# Altium schematic sheet dv_spectrum_main.SchDoc
size A3
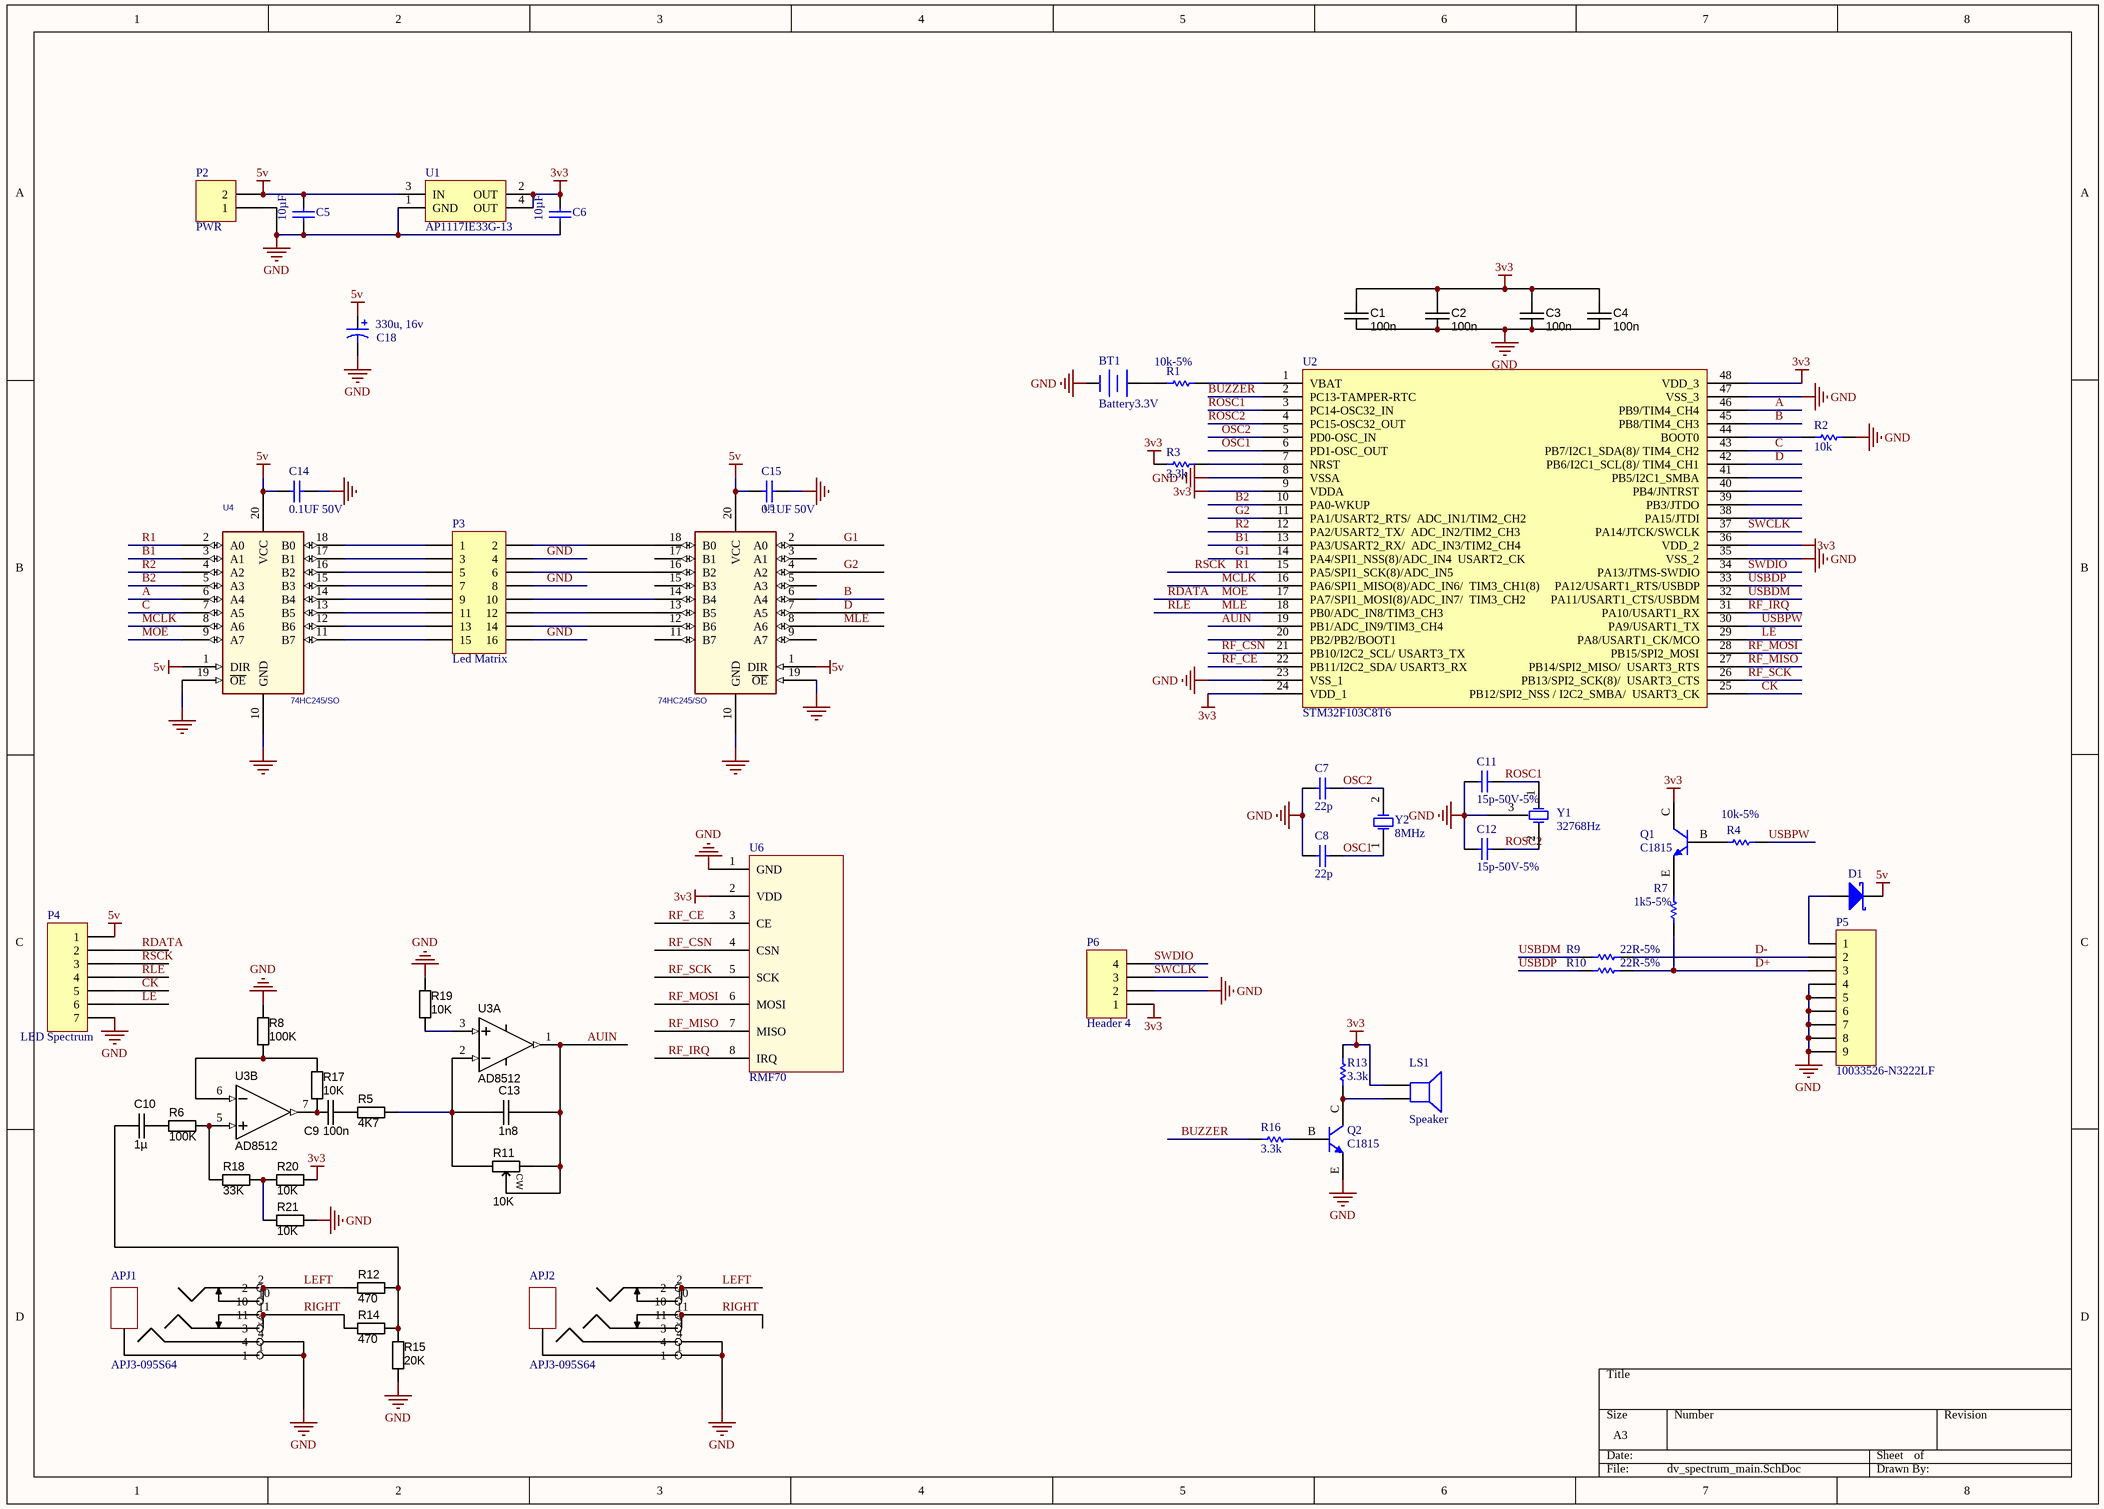
[diagram p0: dv_spectrum_main.SchDoc]

## Parts
APJ1  APJ3-095S64  [APJ3-095S64]
APJ2  APJ3-095S64  [APJ3-095S64]
BT1  Battery3.3V  [CR1220]
C1  value 100n  [CAPC2012X135N]  (hidden comment: approved sub OK)
C2  value 100n  [CAPC2012X135N]  (hidden comment: approved sub OK)
C3  value 100n  [CAPC2012X135N]  (hidden comment: approved sub OK)
C4  value 100n  [CAPC2012X135N]  (hidden comment: approved sub OK)
C5  Capacitance: 10µF  [CAPC3216X180N]  (hidden comment: Ceramic Cap 1206 10uF 25V 10% X5R)
C6  Capacitance: 10µF  [CAPC3216X180N]  (hidden comment: Ceramic Cap 1206 10uF 25V 10% X5R)
C7  22p  [CAPC2012X135N]
C8  22p  [CAPC2012X135N]
C9  value 100n  [CAPC2012X135N]  (hidden comment: approved sub OK)
C10  value 1µ  [CAPC2012X135N]  (hidden comment: approved sub OK)
C11  15p-50V-5%  [CAPC2012X135N]
C12  15p-50V-5%  [CAPC2012X135N]
C13  value 1n8  [CAPC2012X135N]  (hidden comment: approved sub OK)
C14  0.1UF 50V  [CAPC2012X135N]
C15  0.1UF 50V  [CAPC2012X135N]
C18  330u, 16v  [CAPACITOR SIZE_F(D8.3)]
D1  SSB44  [DO-214AC (SMA)]  (value not drawn)
LS1  Speaker  [BUZZER-SMD]
P2  PWR  [DOMINO SMALL]
P3  Led Matrix  [HDR2X8]
P4  LED Spectrum  [HDR1X7]
P5  10033526-N3222LF  [USB MINI B RECEPTACLE-M]
P6  Header 4  [HEADER_MALE_STRAIGHT_1x4]
Q1  C1815  [SC-43-BCE]
Q2  C1815  [SC-43-BCE]
R1  10k-5%  [RESC2012X70N]
R2  Resistance (Ohms): 10k  [RESC2012X70N]  (hidden comment: RES 3.30K OHM 1/8W)
R3  Resistance (Ohms): 3.3k  [RESC2012X70N]  (hidden comment: RES 3.30K OHM 1/8W)
R4  10k-5%  [RESC2012X70N]
R5  value 4K7  [R0805]  (hidden comment: Thick Film)
R6  value 100K  [RESC2012X70N]  (hidden comment: Thick Film)
R7  1k5-5%  [RESC2012X70N]
R8  value 100K  [RESC2012X70N]  (hidden comment: Thick Film)
R9  22R-5%  [RESC2012X70N]
R10  22R-5%  [RESC2012X70N]
R11  value 10K  [TRIMPOT_THT_PV36X]  (hidden comment: 25 turns)
R12  value 470  [RESC2012X70N]  (hidden comment: Thick Film)
R13  Resistance (Ohms): 3.3k  [RESC2012X70N]  (hidden comment: RES 3.30K OHM 1/8W)
R14  value 470  [RESC2012X70N]  (hidden comment: Thick Film)
R15  value 20K  [RESC2012X70N]  (hidden comment: Thick Film)
R16  Resistance (Ohms): 3.3k  [RESC2012X70N]  (hidden comment: RES 3.30K OHM 1/8W)
R17  value 10K  [RESC2012X70N]  (hidden comment: Thick Film)
R18  value 33K  [RESC2012X70N]  (hidden comment: Thick Film)
R19  value 10K  [R0805]  (hidden comment: Thick Film)
R20  value 10K  [R0805]  (hidden comment: Thick Film)
R21  value 10K  [R0805]  (hidden comment: Thick Film)
U1  AP1117IE33G-13  [SOT223]
U2  STM32F103C8T6  [TQFP-48-P0.5]
U3  AD8512  [SOIC127P600X175-8AN]  (parts A,B of 2)
U4  74HC245/SO  [SO20-150mil]
U5  74HC245/SO  [SO20-150mil]
U6  RMF70  [RFM70S]
Y1  32768Hz  [cylindrical crystal]
Y2  8MHz  [HC49/US]

## Nets
3v3: C1.1 C2.1 C3.1 C4.1 C6.2 LS1.1 P6.1 Q1.C R3.1 R13.2 R20.1 U1.2(OUT) U1.4(OUT) U2.9(VDDA) U2.24(VDD_1) U2.36(VDD_2) U2.48(VDD_3) U3.8(V+) U6.2(VDD)
5v: C5.2 C14.2 C15.2 C18.1 D1.2(K) P2.2 P4.1 U1.3(IN) U4.1(DIR) U4.20(VCC) U5.1(DIR) U5.20(VCC)
GND: APJ1.1 APJ1.4 APJ2.1 APJ2.4 BT1.2(-) C1.2 C2.2 C3.2 C4.2 C5.1 C6.1 C7.1 C8.1 C11.1 C12.1 C14.1 C15.1 C18.2 P2.1 P3.4 P3.8 P3.16 P4.7 P5.4 P5.5 P5.6 P5.7 P5.8 P5.9 P6.2 Q2.E R2.2 R8.2 R15.1 R19.1 R21.1 U1.1(GND) U2.8(VSSA) U2.23(VSS_1) U2.35(VSS_2) U2.47(VSS_3) U3.4(V-) U4.10(GND) U4.19(~{OE}) U5.10(GND) U5.19(~{OE}) U6.1(GND) Y1.3
A: U2.46(PB9/TIM4_CH4) U4.6(A4)
AUIN: C13.2 R11.CW R11.W U2.19(PB1/ADC_IN9/TIM3_CH4) U3.1(OUT)
B: U2.45(PB8/TIM4_CH3) U5.6(A4)
B1: U2.13(PA3/USART2_RX/__ADC_IN3/TIM2_CH4) U4.3(A1)
B2: U2.10(PA0-WKUP) U4.5(A3)
BUZZER: R16.1 U2.2(PC13-TAMPER-RTC)
C: U2.43(PB7/I2C1_SDA(8)/_TIM4_CH2) U4.7(A5)
CK: P4.5 U2.25(PB12/SPI2_NSS_/_I2C2_SMBA/__USART3_CK)
D: U2.42(PB6/I2C1_SCL(8)/_TIM4_CH1) U5.7(A5)
D+: P5.3 R7.1 R10.2
D-: P5.2 R9.2
G1: U2.14(PA4/SPI1_NSS(8)/ADC_IN4__USART2_CK) U5.2(A0)
G2: U2.11(PA1/USART2_RTS/__ADC_IN1/TIM2_CH2) U5.4(A2)
LE: P4.6 U2.29(PA8/USART1_CK/MCO)
LEFT: APJ1.2 APJ1.10 APJ2.2 APJ2.10 R12.1
MCLK: U2.16(PA6/SPI1_MISO(8)/ADC_IN6/__TIM3_CH1(8)) U4.8(A6)
MLE: P4.4 U2.18(PB0/ADC_IN8/TIM3_CH3) U5.8(A6)  [also labelled RLE]
MOE: P4.2 U2.17(PA7/SPI1_MOSI(8)/ADC_IN7/__TIM3_CH2) U4.9(A7)  [also labelled RDATA]
OSC1: C8.2 U2.6(PD1-OSC_OUT) Y2.1(OSC1)
OSC2: C7.2 U2.5(PD0-OSC_IN) Y2.2(OSC2)
R1: P4.3 U2.15(PA5/SPI1_SCK(8)/ADC_IN5) U4.2(A0)  [also labelled RSCK]
R2: U2.12(PA2/USART2_TX/__ADC_IN2/TIM2_CH3) U4.4(A2)
RF_CE: U2.22(PB11/I2C2_SDA/_USART3_RX) U6.3(CE)
RF_CSN: U2.21(PB10/I2C2_SCL/_USART3_TX) U6.4(CSN)
RF_IRQ: U2.31(PA10/USART1_RX) U6.8(IRQ)
RF_MISO: U2.27(PB14/SPI2_MISO/__USART3_RTS) U6.7(MISO)
RF_MOSI: U2.28(PB15/SPI2_MOSI) U6.6(MOSI)
RF_SCK: U2.26(PB13/SPI2_SCK(8)/__USART3_CTS) U6.5(SCK)
RIGHT: APJ1.3 APJ1.11 APJ2.3 APJ2.11 R14.1
ROSC1: C11.2 U2.3(PC14-OSC32_IN) Y1.1(OSC1)
ROSC2: C12.2 U2.4(PC15-OSC32_OUT) Y1.2(OSC2)
SWCLK: P6.3 U2.37(PA14/JTCK/SWCLK)
SWDIO: P6.4 U2.34(PA13/JTMS-SWDIO)
USBDM: R9.1 U2.32(PA11/USART1_CTS/USBDM)
USBDP: R10.1 U2.33(PA12/USART1_RTS/USBDP)
USBPW: R4.1 U2.30(PA9/USART1_TX)
NetBT1_1: BT1.1(+) R1.2
NetC9_1: C9.1 R17.1 U3.7(OUT)
NetC9_2: C9.2 R5.1
NetC10_1: C10.1 R12.2 R14.2 R15.2
NetC10_2: C10.2 R6.1
NetC13_1: C13.1 R5.2 R11.CCW U3.2(IN-)
NetD1_1: D1.1(A) P5.1
NetLS1_2: LS1.2 Q2.C R13.1
NetP3_1: P3.1 U4.18(B0)
NetP3_2: P3.2 U5.18(B0)
NetP3_3: P3.3 U4.17(B1)
NetP3_5: P3.5 U4.16(B2)
NetP3_6: P3.6 U5.16(B2)
NetP3_7: P3.7 U4.15(B3)
NetP3_9: P3.9 U4.14(B4)
NetP3_10: P3.10 U5.14(B4)
NetP3_11: P3.11 U4.13(B5)
NetP3_12: P3.12 U5.13(B5)
NetP3_13: P3.13 U4.12(B6)
NetP3_14: P3.14 U5.12(B6)
NetP3_15: P3.15 U4.11(B7)
NetQ1_B: Q1.B R4.2
NetQ1_E: Q1.E R7.2
NetQ2_B: Q2.B R16.2
NetR1_1: R1.1 U2.1(VBAT)
NetR2_1: R2.1 U2.44(BOOT0)
NetR3_2: R3.2 U2.7(NRST)
NetR6_2: R6.2 R18.1 U3.5(IN+)
NetR8_1: R8.1 R17.2 U3.6(IN-)
NetR18_2: R18.2 R20.2 R21.2
NetR19_2: R19.2 U3.3(IN+)

Not connected (* = marked no-connect by the designer): U2 20(PB2/PB2/BOOT1) 38(PA15/JTDI) 39(PB3/JTDO) 40(PB4/JNTRST) 41(PB5/I2C1_SMBA); U5 3(A1) 5(A3) 9(A7) 11(B7) 15(B3) 17(B1)

## Library data of the parts
BT1 = Battery3.3V: Multicell Battery; Published: 24-Mar-1999; LatestRevisionDate: 17-Jul-2002; LatestRevisionNote: Re-released for DXP Platform.; PackageReference: BAT-2; Publisher: Altium Limited
C1-C4 = CAPC_100n_0805_X7R_100V_10%: Capacitor SMD Cer 100nF 10% 100V X7R 0805; Manufacturer 1: TDK Corporation; Manufacturer Part Number 1: C2012X7R2A104K; Ratings: 100V; X7R; Material: ceramic; SCDType: undef; Package / Case: 0805; Tolerance: ±10%; Supplier 1: Digi-Key; Supplier Part Number 1: 445-1418-1-ND
C5 C6 = GRM31CR61E106KA12: Cap 1206 10uF 25V 10% X5R; Manufacturer: Murata Electronics North America; Manufacturer Part Number: GRM31CR61E106KA12L; Supplier 1: Digi-Key; Supplier Part Number 1: 490-3373-6-ND; RoHS: RoHS Compliant; Category: Capacitors; Stock 1: 459851; Pricing 1: 1=0.35, 10=0.292, 50=0.1642, 100=0.146, 250=0.10952, 500=0.09672, 1000=0.08578 (USD); Packaging: Digi-Reel®; Voltage - Rated: 25V; Tolerance: ±10%; Temperature Coefficient: X5R; Mounting Type: Surface Mount, MLCC; Operating Temperature: -55°C ~ 85°C; Applications: General Purpose; Ratings: -; Package / Case: 1206 (3216 Metric); Size / Dimension: 0.126" L x 0.063" W (3.20mm x 1.60mm); Height - Seated (Max): -; Thickness (Max): 0.071" (1.80mm); Lead Spacing: -; Features: -; Lead Style: -; ComponentLink1URL: http://search.murata.co.jp/Ceramy/image/img/A01X/G101/ENG/GRM31CR61E106KA12-01.pdf; ComponentLink1Description: http://search.murata.co.jp/Ceramy/image/img/A01X/G101/ENG/GRM31CR61E106KA12-01.pdf
C7 C8 = Cap Semi: Capacitor (Semiconductor SIM Model); Published: 8-Jun-2000; LatestRevisionDate: 29-May-2009; LatestRevisionNote: IPC-7351 Footprint Added.; PackageReference: C1206; Publisher: Altium Limited; PackageDescription: Chip Capacitor
C9 = CAPC_100n_0805_X7R_50V_10%: Capacitor SMD Cer 100nF 10% 50V X7R 0805; Manufacturer 1: Kemet; Manufacturer Part Number 1: C0805C104K5RACTU; Ratings: 50V; X7R; Material: ceramic; SCDType: undef; Package / Case: 0805 (2012 metric); Tolerance: ±10%; Supplier 1: Digi-Key; Supplier Part Number 1: 399-1170-1-ND
C10 = CAPC_1u_0805_X7R_16V_10%: Capacitor SMD Cer 1uF 10% 16V X7R 0805; Manufacturer 1: Yageo; Manufacturer Part Number 1: CC0805KKX7R7BB105; Ratings: 16V; X7R; Material: ceramic; SCDType: spec; Package / Case: 0805 (2012 metric); Tolerance: ±10%; Supplier 1: Digi-Key; Supplier Part Number 1: 311-1365-6-ND; RoHS 1: RoHS Compliant; Temperature Coefficient: X7R; ComponentLink1URL: http://www.yageo.com/documents/recent/UPY-GPHC_X7R_6.3V-to-50V_8.pdf; ComponentLink1Description: http://www.yageo.com/documents/recent/UPY-GPHC_X7R_6.3V-to-50V_8.pdf; Supplier 2: Digi-Key; Supplier Part Number 2: 399-1284-6-ND; Manufacturer 2: Kemet; Manufacturer Part Number 2: C0805C105K4RACTU; RoHS 2: RoHS Compliant; ComponentLink2URL: http://www.kemet.com/datasheets&C0805C105K4RACTU; ComponentLink2Description: http://www.kemet.com/datasheets&C0805C105K4RACTU; Supplier 3: Digi-Key; Supplier Part Number 3: 1276-1026-6-ND; Manufacturer 3: Samsung Electro-Mechanics America, Inc; Manufacturer Part Number 3: CL21B105KOFNNNE; RoHS 3: RoHS Compliant; ComponentLink3URL: http://www.samsungsem.com/servlet/FileDownload?type=spec&file=CL21B105KOFNNNE.pdf; ComponentLink3Description: http://www.samsungsem.com/servlet/FileDownload?type=spec&file=CL21B105KOFNNNE.pdf; Supplier 4: Digi-Key; Supplier Part Number 4: 445-1358-6-ND; Manufacturer 4: TDK Corporation; Manufacturer Part Number 4: C2012X7R1C105K125AA; RoHS 4: RoHS Compliant; ComponentLink4URL: http://product.tdk.com/capacitor/mlcc/en/documents/mlcc_commercial_general_en.pdf; ComponentLink4Description: http://product.tdk.com/capacitor/mlcc/en/documents/mlcc_commercial_general_en.pdf
C11 C12 = Cap: CAP CER 15PF 50V 5% NPO 0603; Manufacturer: Yageo; Manufacturer Part Number: CC0603JRNPO9BN150; Published: 8-Jun-2000; LatestRevisionDate: 17-Jul-2002; LatestRevisionNote: Re-released for DXP Platform.; PackageReference: C0603; Publisher: Altium Limited; Value: 15p-50V-5%; Digi-Key Part Number: 311-1060-1-ND; Unit Price: 0.01338
C13 = CAPC_1n8_50V_0805: Capacitor SMD Cer 1.8nF 10% 50V X7R 0805; Manufacturer 1: AVX Corporation; Manufacturer Part Number 1: 08055C182KAT2A; Ratings: 50V; X7R; SCDType: source*; Tolerance: ±10%; Operating Temperature: -55°C ~ 125°C; Package / Case: 0805 (2012 metric); Supplier 1: Digi-Key; Supplier Part Number 1: 478-1374-1-ND
C14 C15 = CC0805ZRY5V9BB104: CAP CER 0.1UF 50V Y5V 0805; Manufacturer: Yageo; Capacitance: 0.1µF; Tolerance: -20%, +80%; Temperature Coefficient: Y5V (F); Supplier 1: Digi-Key; Supplier Part Number 1: 311-1361-2-ND; Manufacturer Part Number: CC0805ZRY5V9BB104; RoHS: RoHS Compliant; Category: Capacitors; Stock 1: 412000; Pricing 1: 4000=0.00589, 8000=0.00538, 12000=0.00512, 28000=0.00486, 100000=0.00352 (USD); Packaging: Tape & Reel (TR); Voltage - Rated: 50V; Mounting Type: Surface Mount, MLCC; Operating Temperature: -30°C ~ 85°C; Applications: General Purpose; Ratings: -; Package / Case: 0805 (2012 Metric); Size / Dimension: 0.079" L x 0.049" W (2.00mm x 1.25mm); Height - Seated (Max): -; Thickness (Max): 0.024" (0.60mm); Lead Spacing: -; Features: -; Lead Style: -; ComponentLink1URL: http://www.yageo.com/documents/recent/UPY-GPHC_Y5V_6.3V-to-50V_5.pdf; ComponentLink1Description: http://www.yageo.com/documents/recent/UPY-GPHC_Y5V_6.3V-to-50V_5.pdf
C18 = Cap Pol3: Polarized Capacitor (Surface Mount); Published: 8-Jun-2000; LatestRevisionDate: 29-May-2009; LatestRevisionNote: IPC-7351 Footprint Added.; PackageReference: C0805; Publisher: Altium Limited; PackageDescription: Chip Capacitor
D1 = SSB44: Schottky Diode 40V 4A SMB; Manufacturer: Vishay Semiconductor Diodes Division; Manufacturer Part Number: SSB44-E3/52T; Voltage - Forward (Vf) (Max) @ If: 490mV @ 4A; Speed: Fast Recovery =< 500ns, > 200mA (Io); Current - Reverse Leakage @ Vr: 400µA @ 40V; Thermal Resistance: 23°C/W Jl; Supplier 1: Digi-Key; Supplier Part Number 1: SSB44-E3/52TGITR-ND; RoHS: RoHS Compliant; Category: Discrete Semiconductor Products; Stock 1: 27000; Pricing 1: 750=0.1664, 1500=0.14976, 2250=0.13728, 5250=0.12896, 18750=0.12064, 37500=0.11066, 75000=0.10608 (USD); Packaging: Tape & Reel (TR); Diode Type: Schottky; Voltage - DC Reverse (Vr) (Max): 40V; Current - Average Rectified (Io): 4A; Reverse Recovery Time (trr): -; Capacitance @ Vr, F: -; Mounting Type: Surface Mount; Package / Case: DO-214AA, SMB; Supplier Device Package: DO-214AA (SMB); Operating Temperature - Junction: -65°C ~ 150°C; ComponentLink1URL: http://www.vishay.com/docs/88884/ssb43l.pdf; ComponentLink1Description: http://www.vishay.com/docs/88884/ssb43l.pdf
LS1 = Speaker: Loudspeaker; Published: 24-Mar-1999; LatestRevisionDate: 17-Jul-2002; LatestRevisionNote: Re-released for DXP Platform.; PackageReference: PIN2; Publisher: Altium Limited
P2 = Header 2: Header, 2-Pin; LatestRevisionDate: 17-Jul-2002; LatestRevisionNote: Re-released for DXP Platform.; Publisher: Altium Limited
P3 = Header 8X2: Header, 8-Pin, Dual row; LatestRevisionDate: 17-Jul-2002; LatestRevisionNote: Re-released for DXP Platform.; Publisher: Altium Limited
P4 = Header 7: Header, 7-Pin; LatestRevisionDate: 17-Jul-2002; LatestRevisionNote: Re-released for DXP Platform.; Publisher: Altium Limited
P5 = Header 9: CONN RCPT USB MINI B R/A SMD; Manufacturer: Hirose Electric Co Ltd; Manufacturer Part Number: UX60SC-MB-5ST(80); LatestRevisionDate: 17-Jul-2002; LatestRevisionNote: Re-released for DXP Platform.; Publisher: Altium Limited; Digi-Key Part Number: H11671TR-ND; Unit Price: 0.30000
P6 = Header 4: Header, 4-Pin; LatestRevisionDate: 17-Jul-2002; LatestRevisionNote: Re-released for DXP Platform.; Publisher: Altium Limited
Q1 Q2 = NPN Transistor: TRANSISTOR NPN 50V 150MA; Unit Price: 0.02500
R1 R4 = Res1: RES 10K OHM 1/10W 5% 0603 SMD; Manufacturer: Yageo; Manufacturer Part Number: RC0603JR-0710KL; Published: 8-Jun-2000; LatestRevisionDate: 17-Jul-2002; LatestRevisionNote: Re-released for DXP Platform.; PackageReference: R0603; Publisher: Altium Limited; Value: 10k-5%; Digi-Key Part Number: 311-10KGRCT-ND; Unit Price: 0.00207
R2 R3 R13 R16 = RC0805FR-073K3L: RES 3.30K OHM 1/8W 1% 0805 SMD; Manufacturer: Yageo; Power (Watts): 0.125W, 1/8W; Temperature Coefficient: ±100ppm/°C; Supplier 1: Digi-Key; Supplier Part Number 1: 311-3.30KCRCT-ND; Manufacturer Part Number: RC0805FR-073K3L; RoHS: RoHS Compliant; Category: Resistors; Stock 1: 180290; Pricing 1: 1=0.1, 10=0.019, 25=0.0148, 100=0.0089, 250=0.00764, 500=0.0054, 1000=0.00381, 2500=0.0033 (USD); Packaging: Cut Tape (CT); Tolerance: ±1%; Composition: Thick Film; Features: -; Package / Case: 0805 (2012 Metric); Supplier Device Package: 0805; Size / Dimension: 0.079" L x 0.049" W (2.00mm x 1.25mm); Height: 0.024" (0.60mm); Number of Terminations: 2; ComponentLink1URL: http://media.digikey.com/pdf/Data%20Sheets/Yageo%20PDFs/RC0805%20Pb%20Free.pdf; ComponentLink1Description: http://media.digikey.com/pdf/Data%20Sheets/Yageo%20PDFs/RC0805%20Pb%20Free.pdf
R5 R12 R14 = RES_4K7_0805_5%: Resistor SMD chip 4.7k Ohm 0.125W 5% 0805; Manufacturer 1: Yageo; Manufacturer Part Number 1: RC0805JR-074K7L; Ratings: 1/8 W; SCDType: spec; Package / Case: 0805 (2012 metric); Tolerance: ±5%; Material: Thick Film; Supplier 1: Digi-Key; Supplier Part Number 1: 311-4.7KARCT-ND
R6 R8 R15 R17-R21 = RES_10K_0805_5%: Resistor SMD chip 10k Ohm 0.125W 5% 0805; Manufacturer 1: Yageo; Manufacturer Part Number 1: RC0805JR-0710KL; Ratings: 1/8 W; SCDType: spec; Package / Case: 0805 (2012 metric); Tolerance: ±5%; Material: Thick Film; Supplier 1: Digi-Key; Supplier Part Number 1: 311-10KARCT-ND
R7 = Res1: RES 1.5K OHM 1/10W 5% 0603 SMD; Manufacturer: Yageo; Manufacturer Part Number: RC0603JR-071K5L; Published: 8-Jun-2000; LatestRevisionDate: 17-Jul-2002; LatestRevisionNote: Re-released for DXP Platform.; PackageReference: R0603; Publisher: Altium Limited; Value: 1k5-5%; Digi-Key Part Number: 311-1.5KGRCT-ND; Unit Price: 0.00207
R9 R10 = Res1: RES 22 OHM 1/10W 5% 0603 SMD; Manufacturer: Yageo; Manufacturer Part Number: RC0603JR-0722RL; Published: 8-Jun-2000; LatestRevisionDate: 17-Jul-2002; LatestRevisionNote: Re-released for DXP Platform.; PackageReference: R0603; Publisher: Altium Limited; Value: 22R-5%; Digi-Key Part Number: 311-22GRCT-ND; Unit Price: 0.00207
R11 = RES_TRIMMER_10K_25T_THT: Trimmer THD 10K 500mW 25-turn; Manufacturer 1: Murata Electronics North America; Manufacturer Part Number 1: PV36X103C01B00; Tolerance: ±10%; Ratings: 1/2W; ±100ppm/°C; SCDType: spec; Material: Cermet; Package / Case: 10.9mm L x 5.0mm W x 10.0mm H; Supplier 1: Digi-Key; Supplier Part Number 1: 490-2894-ND
U1 = AP1117IE33G-13: 1A Low Dropout Positive Regulator 3.3V; Manufacturer: Diodes Incorporated; Number of Outputs: 1 Output; Output Type: Fixed; Product Status: New Product; Supplier 1: Mouser; Supplier Part Number 1: 621-AP1117IE33G-13; Manufacturer Part Number: AP1117IE33G-13; RoHS: RoHS Compliant; Category: LDO Voltage Regulators; Stock 1: 8131; Pricing 1: 1=0.410, 10=0.271, 100=0.221, 250=0.184, 500=0.151, 1000=0.113, 2500=0.101, 5000=0.095, 10000=0.089 (USD); Output Current: 1 A; Output Voltage: 3.3 V; Package / Case: SOT223-3L; Packaging: Reel; Mounting Style: SMD/SMT; RoHS - Mouser: Y; Minimum Order Quantity: 1; Reeling: True; ComponentLink1URL: http://www.mouser.com/ds/2/115/AP1117-82280.pdf; ComponentLink1Description: http://www.mouser.com/ds/2/115/AP1117-82280.pdf
U2 = STM32F103C8T6: 48pins, 64 KBytes Flash, 20 KBytes SRAM, 1x I2C, 1x SPI (18 Mbit/s); Datasheet: http://www.st.com/internet/com/TECHNICAL_RESOURCES/TECHNICAL_LITERATURE/DATASHEET/CD00210831.pdf
U3 = IC_Op-Amp_AD8512: IC SMD Low Cost Op Amp SOIC-8; Manufacturer 1: Analog Devices Inc; Manufacturer Part Number 1: AD8512BRZ; Voltage - Supply: 2.7 V ~ 16 V, ±1.35 V ~ 8 V; SCDType: spec?; Package / Case: 8-SOIC (0.154", 3.90mm Width); Supplier 1: Digi-Key; Supplier Part Number 1: AD8512BRZ-ND
U4 U5 = 74HC245/SO_1
Y1 = XTAL: CRYSTAL 32.000 KHZ 12.5PF CYL; Manufacturer: Citizen Finetech Miyota; Manufacturer Part Number: CFV206-32.000KAZF-UB; Published: 8-Jun-2000; LatestRevisionDate: 17-Jul-2002; LatestRevisionNote: Re-released for DXP Platform.; PackageReference: R38; Publisher: Altium Limited; Digi-Key Part Number: 300-8402-ND; Unit Price: 0.11
Y2 = XTAL: Crystal Oscillator; Published: 8-Jun-2000; LatestRevisionDate: 17-Jul-2002; LatestRevisionNote: Re-released for DXP Platform.; PackageReference: R38; Publisher: Altium Limited